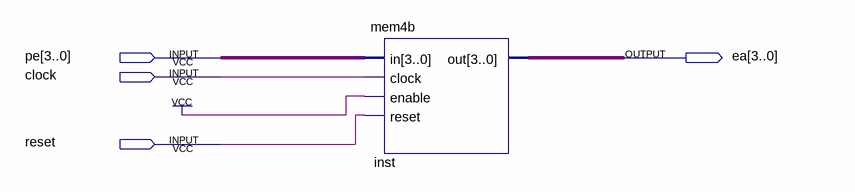
[diagram p0: schematic sheet]
// Quartus schematic reg_estados.bdf as structural Verilog: 1 symbols, 4 pins
module reg_estados (
  input  [3:0] pe,
  input  clock,
  input  reset,
  output [3:0] ea
);

  mem4b inst (.in(pe), .clock(clock), .enable(1'b1), .reset(reset), .out(ea));
endmodule
